# Altium schematic sheet 00_POWER.SchDoc: WULPUS High-voltage MUX PCB
size A3; DrawnBy: Sebastian Frey; Organization: Integrated Systems Laboratory; Revision: v1.1; SheetNumber: 1; SheetTotal: 2
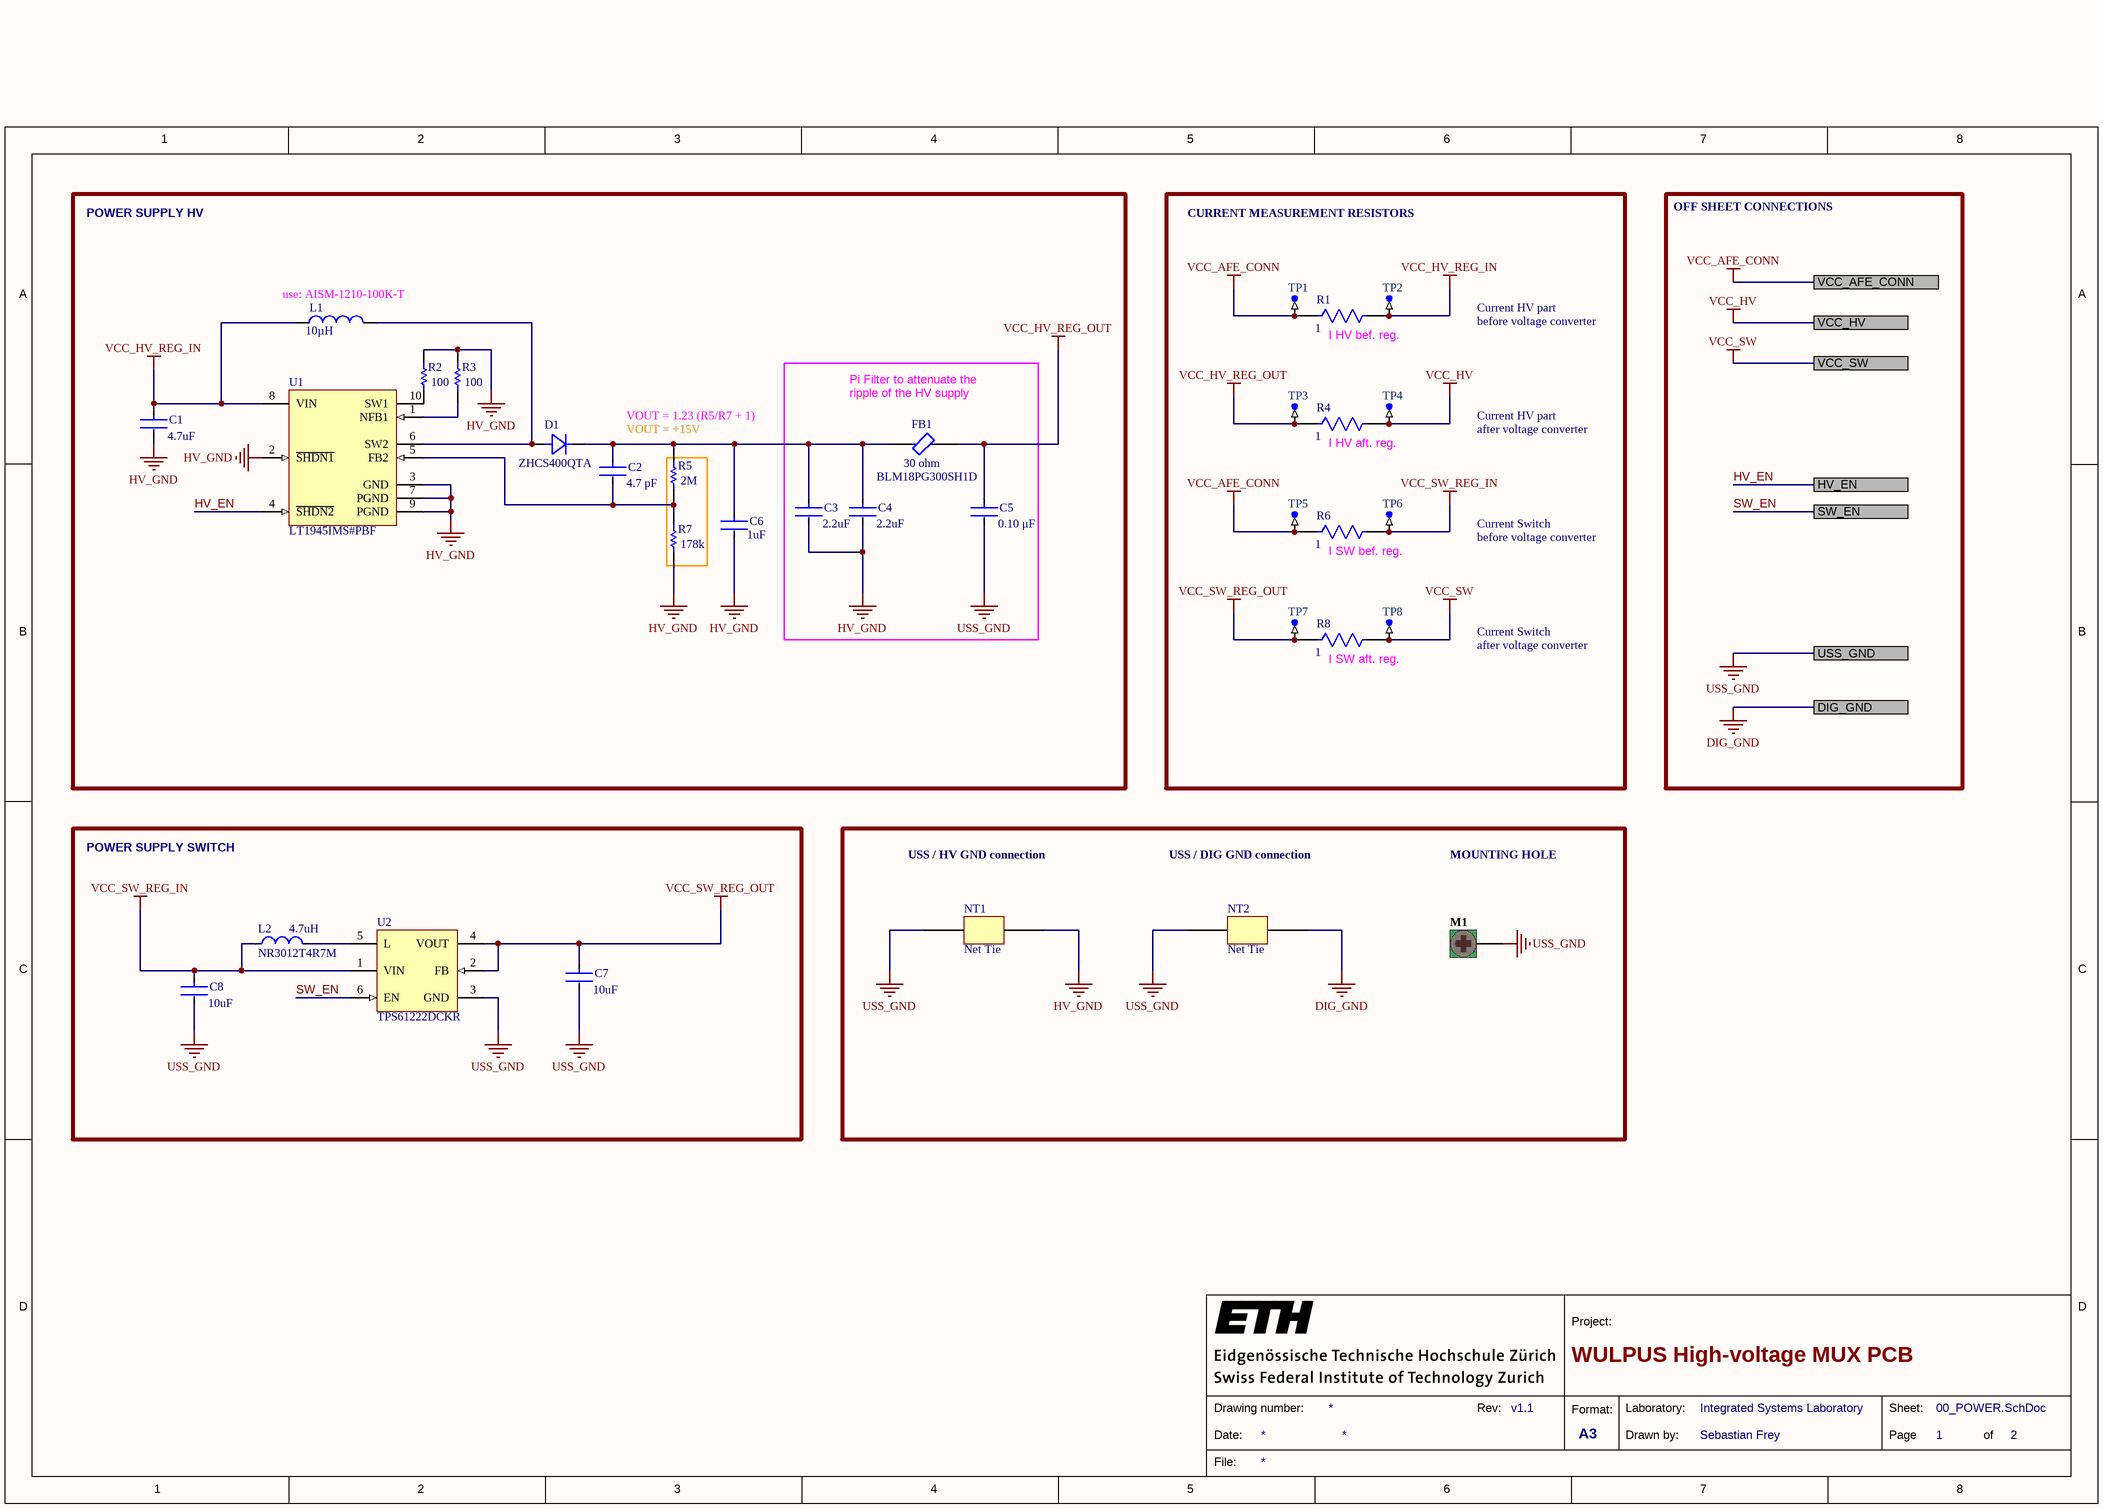
[diagram p0: 00_POWER.SchDoc]

## Parts
C1  Capacitance: 4.7uF  [FP-0603-L_1_6_0_15-W_0_81-MFG]  (hidden comment: 06036D475KAT2A)
C2  Capacitance: 4.7 pF  [FP-C0402-BB-MFG]  (hidden comment: C0402C479C5GACTU)
C3  Capacitance: 2.2uF  [FP-GRM188-0_2-IPC_C]  (hidden comment: GRM188R61H225KE11D)
C4  Capacitance: 2.2uF  [FP-GRM188-0_2-IPC_C]  (hidden comment: GRM188R61H225KE11D)
C5  value 0.10 μF  [FP-C0603C-CF-MFG]  (hidden comment: C0603C104M5RACTU)
C6  Capacitance: 1uF  [FP-1206-L_3_2_0_15-W_1_6-IPC_B]  (hidden comment: GMK316BJ105KLHT)
C7  Capacitance: 10uF  [FP-GRM188-0_1-e0_2_0_55-IPC_A]  (hidden comment: GRM188R60J106ME47D)
C8  Capacitance: 10uF  [FP-GRM188-0_1-e0_2_0_55-IPC_A]  (hidden comment: GRM188R60J106ME47D)
D1  ZHCS400QTA  [DIODE_SOD323_DIO]
FB1  BLM18PG300SH1D  Impedance: 30 ohm  [FP-BLM18-0_15-t0_8-IPC_A]
L1  Inductance: 10µH  [TDK-B82422A1103K100_V]  (hidden comment: B82422A1103K100)
L2  NR3012T4R7M  Inductance: 4.7uH  [FP-NR3012-MFG]
M1  Mounting Hole for AFE PCB  [Hole M2]  (value not drawn)  (no BOM)
NT1  Net Tie  [Net_Tie_Top_Bottom]  (net tie, no BOM)
NT2  Net Tie  [Net_Tie_Top_Bottom]  (net tie, no BOM)
R1  Resistance: 1  [FP-CSR0402-MFG]  (hidden comment: CSR0402FK1R00)
R2  Resistance: 100  [RESC1005X40X25NL05T05]  (hidden comment: ERJ-2GEJ101X)
R3  Resistance: 100  [RESC1005X40X25NL05T05]  (hidden comment: ERJ-2GEJ101X)
R4  Resistance: 1  [FP-CSR0402-MFG]  (hidden comment: CSR0402FK1R00)
R5  Resistance: 2M  [RESC1005X40X25NL05T10]  (hidden comment: RC0402FR-072ML)
R6  Resistance: 1  [FP-CSR0402-MFG]  (hidden comment: CSR0402FK1R00)
R7  Resistance: 178k  [RESC1005X40X25ML05T05]  (hidden comment: ERJ-2RKF1783X)
R8  Resistance: 1  [FP-CSR0402-MFG]  (hidden comment: CSR0402FK1R00)
TP1  TP-SM-C-100  [TP-SM-C-100]  (value not drawn)  (no BOM)
TP2  TP-SM-C-100  [TP-SM-C-100]  (value not drawn)  (no BOM)
TP3  TP-SM-C-100  [TP-SM-C-100]  (value not drawn)  (no BOM)
TP4  TP-SM-C-100  [TP-SM-C-100]  (value not drawn)  (no BOM)
TP5  TP-SM-C-100  [TP-SM-C-100]  (value not drawn)  (no BOM)
TP6  TP-SM-C-100  [TP-SM-C-100]  (value not drawn)  (no BOM)
TP7  TP-SM-C-100  [TP-SM-C-100]  (value not drawn)  (no BOM)
TP8  TP-SM-C-100  [TP-SM-C-100]  (value not drawn)  (no BOM)
U1  LT1945IMS#PBF  [LT-MS-10_L]
U2  TPS61222DCKR  [DCK0006A_L]

## Blocks framed on the sheet
POWER SUPPLY SWITCH: C7 C8 L2 U2

## Ports
DIG_GND, HV_EN, SW_EN, USS_GND, VCC_AFE_CONN, VCC_HV, VCC_SW

## Nets
DIG_GND: NT2.2 ; port DIG_GND
HV_GND: C1.2 C3.2 C4.2 C6.2 NT1.2 R2.2 R3.2 R7.1 U1.2(~{SHDN1}) U1.3(GND) U1.7(PGND) U1.9(PGND)
USS_GND: C5.2 C7.2 C8.2 M1.1 NT1.1 NT2.1 U2.3(GND) ; port USS_GND
VCC_AFE_CONN: R1.1 R6.1 TP1.1 TP5.1 ; port VCC_AFE_CONN
VCC_HV: R4.2 TP4.1 ; port VCC_HV
VCC_HV_REG_IN: C1.1 L1.1 R1.2 TP2.1 U1.8(VIN)
VCC_HV_REG_OUT: C5.1 FB1.2 R4.1 TP3.1
VCC_SW: R8.2 TP8.1 ; port VCC_SW
VCC_SW_REG_IN: C8.1 L2.1 R6.2 TP6.1 U2.1(VIN)
VCC_SW_REG_OUT: C7.1 R8.1 TP7.1 U2.2(FB) U2.4(VOUT)
HV_EN: U1.4(~{SHDN2}) ; port HV_EN
SW_EN: U2.6(EN) ; port SW_EN
NetC2_1: C2.1 C3.1 C4.1 C6.1 D1.1 FB1.1 R5.2
NetC2_2: C2.2 R5.1 R7.2 U1.5(FB2)
NetD1_2: D1.2 L1.2 U1.6(SW2)
NetL2_2: L2.2 U2.5(L)
NetR2_1: R2.1 U1.10(SW1)
NetR3_1: R3.1 U1.1(NFB1)

## Notes on the sheet
- POWER SUPPLY HV
- CURRENT MEASUREMENT RESISTORS
- OFF SHEET CONNECTIONS
- (near L1) use: AISM-1210-100K-T
- Current HV part
- (near R1) I HV bef. reg.
- before voltage converter
- VOUT = 1.23 (R5/R7 + 1)
- VOUT = +15V
- (near FB1) Pi Filter to attenuate the ripple of the HV supply
- (near R4) I HV aft. reg.
- after voltage converter
- (near R6) I SW bef. reg.
- Current Switch
- (near R8) I SW aft. reg.
- USS / HV GND connection
- USS / DIG GND connection
- MOUNTING HOLE
- 1
- 2
- 3
- 4
- 5
- 6
- 7
- 8
- A
- B
- C
- D
- Project:
- Date:
- Drawing number:
- Rev:
- Format:
- A3
- Drawn by:
- Laboratory:
- Page
- Sheet:
- of
- File:

## Library data of the parts
C1 = CMP-2006-04481-2: General Purpose Ceramic Capacitor, 0603, 4.7uF, 10%, X5R, 15%, 6.3V; Tolerance: 20%; Voltage Rating (DC): 6.3V; RoHS Compliant: Yes; Thickness: 0.035inch; Voltage: 6.3V; Number of Pins: 2; Case Code (Metric): 1608; Dielectric: X5R; Height: 0.9mm; Case Code (Imperial): 0603; Contact Plating: Tin; REACH SVHC: No SVHC; Package Quantity: 1; Case/Package: 0603; Lead Free: Lead Free; Series: -; Termination: SMD/SMT; Mount: Surface Mount; Min Operating Temperature: -55°C; Construction: Flat; Packaging: Tape and Reel; Max Operating Temperature: 85°C; Dielectric Material: Ceramic; Voltage Rating: 6.3V; Length: 1.6mm; Depth: 0.81mm; Radiation Hardening: No; Width: 0.032inch
C2 = CMP-2008-03310-2: CAP CER 4.7PF 50V NP0 0402; Manufacturer: Kemet; Material: Ceramic; Tolerance: 0.25 pF; Temperature Coefficient: 15%; Temperature Characteristic: C0G; Manufacturer Part Number: C0402C479C5GACTU; Lead Free: Yes; Device Class L1: Passive Components; ComponentLink2Description: Datasheet; Temperature: -55°C to +125°C; Digikey Description: CAP CER 4.7PF 50V NP0 0402; Ipc Land Pattern Name: CAPC10050X50; ComponentLink2URL: https://content.kemet.com/datasheets/KEM_C1002_X7R_SMD.pdf; Octopart: https://octopart.com/c0402c479c5gactu-kemet-9144199; Mouser Description: Multilayer Ceramic Capacitors MLCC - SMD/SMT 50volts 4.7pF C0G .25pF; Automotive: No; Voltage Rating: 50 V; Device Class L3: Ceramic Capacitors; Category: Cap; Value: 4.7 pF; Package: C0402-BB; Height: 0.55mm; Temperature Range Low: -55°C; RoHS: TRUE; Device Class L2: Capacitors; Temperature Range High: +125°C
C3 C4 = CMP-06035-042125-1: Chip Multilayer Ceramic Capacitors for General Purpose, 0603, 2.2uF, X5R, 15%, 10%, 50V; Case Code (Metric): 1608; Packaging: Cut Tape; REACH SVHC: No SVHC; Material: Ceramic; Voltage Rating: 50V; Min Operating Temperature: -55°C; Length: 0.063inch; Case Code (Imperial): 0603; Tolerance: 10%; Thickness: 0.039inch; Height: 0.8mm; Case/Package: 0603; Voltage Rating (DC): 50V; Dielectric: X5R; Mount: Surface Mount; Max Operating Temperature: 85°C; Width: 0.031inch
C5 = CMP-2006-03068-2: CAP CER 0.1UF 50V 20% X7R 0603; Manufacturer: KEMET; Material: Ceramic; Tolerance: 0.2; Temperature Coefficient: 30ppm/°C; Automotive Grade: Grade 1; Temperature Range High: +125°C; Voltage Rating: 50 V; Device Class L3: Ceramic Capacitors; Manufacturer Part Number: C0603C104M5RACTU; Height: 0.87mm; Category: Cap; RoHS: TRUE; Digikey Description: CAP CER 0.1UF 50V 20% X7R 0603; ComponentLink2URL: https://api.kemet.com/component-edge/download/datasheet/C0603C100J5GACAUTO.pdf; Lead Free: Yes; Temperature Range Low: -55°C; Device Class L1: Passive Components; ComponentLink2Description: Datasheet; Temperature Characteristic: X7R; Automotive: Yes; Temperature: -55°C to +125°C; Octopart: https://octopart.com/c0603c104m5ractu-kemet-11855687; Device Class L2: Capacitors; Package: C0603C-CF; Mouser Description: Multilayer Ceramic Capacitors MLCC - SMD/SMT 50volts 0.1uF X7R 20%; Capacitance: 0.10 μF
C6 = CMP-14477-003256-2: None; Voltage Rating (DC): 35V; Dielectric: X5R; Tolerance: 10%; Halogen Free: Halogen Free; Max Operating Temperature: 85°C; Min Operating Temperature: -55°C; Termination: SMD/SMT; Length: 0.126inch; Package Quantity: 2000; Voltage Rating: 35V; Width: 0.063inch; Case/Package: 1206; Case Code (Imperial): 1206; Case Code (Metric): 3216; Mount: Surface Mount; Packaging: Tape and Reel; Ratings: AEC-Q200; RoHS Compliant: Yes; Height: 1.6mm; Lead Free: Lead Free; Thickness: 0.071inch
C7 C8 = CMP-2006-02792-2: Chip Multilayer Ceramic Capacitors for General Purpose, 0603, 10uF, X5R, 15%, 20%, 6.3V; Packaging: Tape and Reel; Voltage Rating (DC): 6.3V; Width: 0.031inch; Termination: SMD/SMT; Dielectric: X5R; Package Quantity: 4000; Voltage Rating: 6.3V; Case/Package: 0603; Min Operating Temperature: -55°C; Voltage: 6.3V; Length: 1.6mm; Thickness: 0.035inch; Lead Free: Lead Free; Depth: 0.8mm; Case Code (Imperial): 0603; Max Operating Temperature: 85°C; Material: Ceramic; Height: 0.8mm; Tolerance: 20%; Mount: Surface Mount; REACH SVHC: No SVHC; Radiation Hardening: No; Case Code (Metric): 1608
D1 = ZHCS400QTA: Diode Schottky 40V 1A Automotive 2-Pin SOD-323 T/R; Manufacturer: Diodes; Supplier 1: Farnell; RoHS: Yes; Category: Rectifier Diodes; Stock 1: 385; Pricing 1: 5=0.87300, 10=0.73400, 100=0.49400, 500=0.38800 (CHF); Mount: Surface Mount; Packaging: Tape and Reel; Average Rectified Current: 1A; Max Reverse Voltage (DC): 40V; RoHS Compliant: Yes; ComponentLink1URL: http://www.mouser.com/ds/2/115/ZHCS400Q-959646.pdf?src-supplier=Mouser; ComponentLink1Description: http://www.mouser.com/ds/2/115/ZHCS400Q-959646.pdf?src-supplier=Mouser; Supplier Part Number 1: 3127490; Manufacturer Part Number: ZHCS400QTA
FB1 = CMP-06046-000808-1: Chip Ferrite Bead, 0603, 30Ω @ 100MHz, 0.05Ω, , 1A; Tolerance: 25%; Shielding: Unshielded; DC Resistance (DCR): 50mR; Number of Lines: 1; Width: 0.031inch; Termination: SMD/SMT; Case Code (Metric): 1608; Max DC Current: 1A; Case Code (Imperial): 0603; Height: 0.037inch; Max Operating Temperature: 125°C; Max Current Rating: 1A; Case/Package: 0603; Length: 1.6mm; Number of Circuits: 1; Test Frequency: 100MHz; Contact Plating: Tin; Ratings: AEC-Q200; Package Quantity: 1; Mount: Surface Mount; Packaging: Tape and Reel; Min Operating Temperature: -55°C
L1 = CMP-2000-05912-1: Wirewound Inductor, 10 uF, +/- 10%, 180 mA, -55 to 125 degC, 2-Pin SMD, RoHS, Tape and Reel; Manufacturer: EPCOS-(TDK); Frequency - Test: 1MHz; Current Rating: 180mA; Material - Core: Ferrite; DC Resistance (DCR): 1.6OhmMax; Q @ Freq: 27@2.52MHz; Frequency - Self Resonant: 25MHz; Shielding: Unshielded; Series: SIMID; Size / Dimension: 0.126"Lx0.098"W(3.20mmx2.50mm); Mounting Type: SurfaceMount; Current - Saturation: -; Operating Temperature: -; Datasheet URL: https://en.tdk.eu/inf/30/db/ind_2008/b82422a_100.pdf; Ratings: AEC-Q200; Category: Inductors,Coils,Chokes; Mounting Technology: SurfaceMount; Height - Seated (Max): 0.083"(2.10mm); Family: FixedInductors; Package / Case: 1210(3225Metric); Tolerance: ±10%; Manufacturer URL: http://www.tdk.com/; Datasheet Version: 10/2012; Type: Wirewound; Packaging: CutTape(CT); Package Description: 2-Pin Surface Mount Device, Body 3.2 x 2.5 mm; Package Reference: B82422A1103K100
L2 = CMP-14484-001484-1: SMD Power Inductors 4.7uH ±20% 0.77A 0.13Ω; Saturation Current: 770mA; Self Resonant Frequency: 48MHz; RMS Current (Irms): 980mA; Test Frequency: 100kHz; Core Material: Ferrite; Shielding: Shielded; DC Resistance (DCR): 156mR; Series: NR; Case Code (Metric): 3030; Halogen Free: Halogen Free; Tolerance: 20%; Resistor Type: Wirewound; Mount: Surface Mount; Case/Package: 1212; Max DC Current: 770mA; Length: 0.118inch; Height - Seated (Max): 0.047inch; Termination: SMD/SMT; Package Quantity: 2000; DC Current: 980mA; Depth: 3.1mm; Packaging: Tape and Reel; Height: 1.2mm; Current Rating: 980mA; Min Operating Temperature: -25°C; Case Code (Imperial): 1212; Lead Free: Lead Free; Military Standard: Not; Width: 0.118inch; Max Operating Temperature: 120°C; Radiation Hardening: No; Inductance Tolerance: 20%; RoHS Compliant: Yes
M1 = CMP-00274-1: M2 Hole, 2.4mm drill, 5mm landing pads, 3mm pad in middle layers, no overlay; ClassName: Mounting Hole
NT1 NT2 = Net_Tie
R1 R4 R6 R8 = CMP-26527-000038-1: RES 1 OHM 1% 1/8W 0402; Max Power Dissipation: 125mW; Temperature Coefficient: 200ppm/°C; Max Operating Temperature: 155°C; RoHS Compliant: Yes; Case Code (Imperial): 0402; Package Quantity: 1000; Mount: Surface Mount; Width: 0.02inch; Case/Package: 0402; Packaging: Tape and Reel; Resistor Type: Thick Film; Tolerance: 1%; Length: 0.039inch; Case Code (Metric): 1005; Min Operating Temperature: -55°C; Number of Terminations: 2; Series: CSR; Height: 0.017inch
R2 R3 = CMP-2002-00431-1: Manufacturer: Panasonic; Part Number: ERJ-2GEJ101X
R5 = CMP-2002-07066-1: Manufacturer: Yageo / Phycomp; Part Number: RC0402FR-072ML
R7 = CMP-2002-00733-1: Manufacturer: Panasonic; Part Number: ERJ-2RKF1783X
TP1-TP8 = CMP-0484-00002-1: Test Point, Surface Mount, Circular, Pad Diameter 1 mm
U1 = CMP-0478-00154-1: Dual Micropower DC/DC Converter with Positive and Negative Outputs, 1.2 to 15 V Vin, 10-pin SOP (MS-10), -40 to 125 degC, Pb-Free; Manufacturer: Linear Technology; Vin Min(V): 1.2; Vin Max(V): 15; Number of Outputs: 2; Mounting Technology: Surface Mount; ComponentLink3Description: Package Specification; ComponentLink3URL: http://cds.linear.com/docs/en/packaging/05081661_F_MS.pdf; PackageVersion: Rev. E, 06/2010; ComponentLink2URL: http://cds.linear.com/docs/en/datasheet/1945fa.pdf; PartNumber: LT1945IMS#PBF; DatasheetVersion: Rev. A; PackageReference: MS-10; PackageDescription: 10-Pin Plastic MSOP, Body 3 x 3 mm, Pitch 0.5 mm; ComponentLink2Description: Datasheet; RoHS: TRUE; ComponentLink1URL: http://www.linear.com/; ComponentLink1Description: Manufacturer URL
U2 = CMP-0347-00055-2: Boost Voltage Converter with 0.7 to 5.5 V Input and 5 V Output, -40 to 85 degC, 6-Pin SC70 (DCK), Green (RoHS & no Sb/Br); Manufacturer: Texas Instruments; Vout(Min)(V): 5; SubFamily: Step-Up Regulator; Vin(Min)(V): 0.7; Switching Frequency(Max)(kHz): 2000; Regulated Outputs(#): 1; Vin(Max)(V): 5.5; Topology: Boost; Vout(Max)(V): 5; PackageVersion: revG, Jan-2007; Mounting Technology: Surface Mount; ComponentLink2URL: http://www.ti.com/litv/pdf/mpds114c; PackageReference: DCK0006A; DatasheetVersion: SLVS776; PartNumber: TPS61222DCKR; ComponentLink1Description: Datasheet; ComponentLink1URL: http://www.ti.com/general/docs/lit/getliterature.tsp?genericPartNumber=TPS61222&fileType=pdf; ComponentLink2Description: Package Specification; Eco-Plan: Green (RoHS & no Sb/Br); Code_JEDEC: MO-203-AB; PackageDescription: 6-Pin Plastic Small-Outline Package, 2 x 1.3 mm Body, 0.65 mm Pitch, 2.1 mm Lead Span